# EAGLE design quantizer2_v40 (EAGLE 9.6.2)

## Sheet 1 of 2
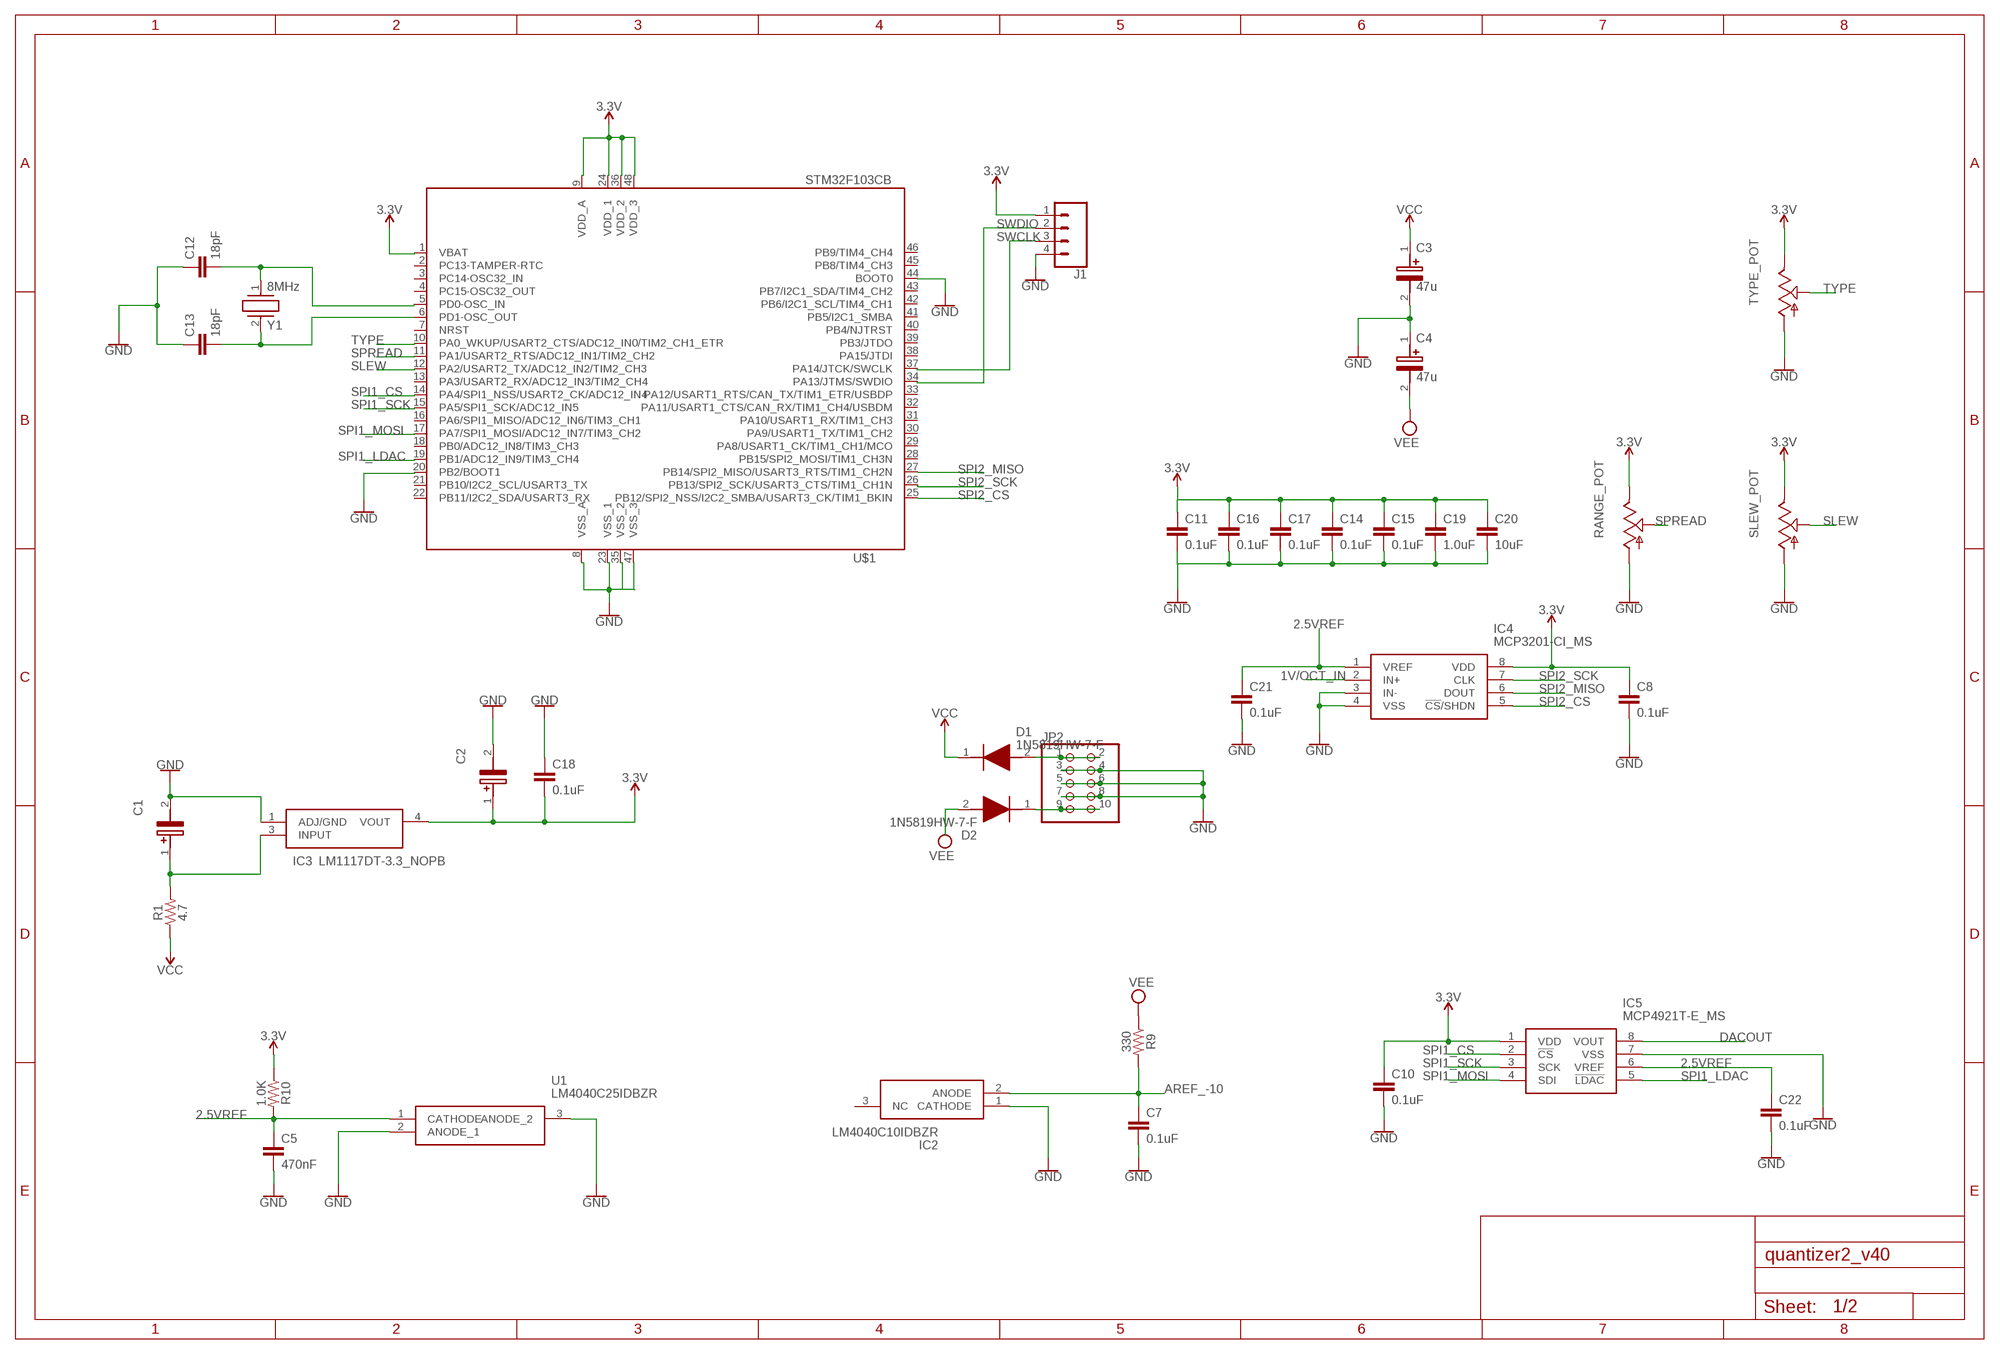
[diagram p0: schematic, sheet 1]

### Parts
C1  22uF  EEE-FP1E220AR  [EEE0GA101SR]
C2  22uF  EEE-FP1E220AR  [EEE0GA101SR]
C3  47u  EEE-FK1V470P  [EEE1AA101SP]
C4  47u  EEE-FK1V470P  [EEE1AA101SP]
C5  470nF  0.1UF-0603-25V-(+80/-20%)  [0603]
C7  0.1uF  0.1UF-0603-25V-(+80/-20%)  [0603]
C8  0.1uF  0.1UF-0603-25V-5%  [0603]
C10  0.1uF  0.1UF-0603-25V-5%  [0603]
C11  0.1uF  0.1UF-0603-25V-5%  [0603]
C12  18pF  18PF-0603-50V-5%  [0603]
C13  18pF  18PF-0603-50V-5%  [0603]
C14  0.1uF  0.1UF-0603-25V-5%  [0603]
C15  0.1uF  0.1UF-0603-25V-5%  [0603]
C16  0.1uF  0.1UF-0603-25V-(+80/-20%)  [0603]
C17  0.1uF  0.1UF-0603-25V-(+80/-20%)  [0603]
C18  0.1uF  0.1UF-0603-25V-(+80/-20%)  [0603]
C19  1.0uF  1.0UF-0603-16V-10%  [0603]
C20  10uF  10UF-0603-6.3V-20%  [0603]
C21  0.1uF  0.1UF-0603-25V-5%  [0603]
C22  0.1uF  0.1UF-0603-25V-5%  [0603]
D1  1N5819HW-7-F  [SOD3716X145N]
D2  1N5819HW-7-F  [SOD3716X145N]
IC2  LM4040C10IDBZR  [SOT95P237X112-3N]
IC3  LM1117DT-3.3_NOPB  [TO228P991X238-3N]
IC4  MCP3201-CI_MS  [SOP65P490X110-8N]
IC5  MCP4921T-E_MS  [SOP65P490X110-8N]
J1  CONN_04  [1X04]
JP2  PINHD-2X5  [2X05]
R1  4.7  RESISTOR1206  [1206]
R9  330  RESISTOR0603  [0603]
R10  1.0K  RESISTOR0603  [0603]
RANGE_POT  POT_USVERTICAL_PS  [ALPS_POT_VERTICAL_PS]
SLEW_POT  POTENTIOMETER-ALPHA-9MM_VERTICAL_  [POTENTIOMETER-ALPHA-9MM_VERTICAL]
TYPE_POT  POT_USVERTICAL_PS  [ALPS_POT_VERTICAL_PS]
U1  LM4040C25IDBZR  [SOT95P237X112-3N]
U$1  STM32F103CB  [LQFP48]
Y1  8MHz  ABLS3-8.000MHZ-D4Y-T  [ABLS]

### Nets
1V/OCT_IN: IC4.2(IN+) ; also sheet 2
2.5VREF: C5.1 C21.1 C22.1 IC4.1(VREF) IC5.6(VREF) R10.2 U1.1(CATHODE)
3.3V: C2.1(+) C8.1 C10.1 C11.1 C14.1 C15.1 C16.1 C17.1 C18.2 C19.1 C20.1 IC3.4(VOUT) IC4.8(VDD) IC5.1(VDD) J1.1 R10.1 RANGE_POT.P$1(E) SLEW_POT.3(E) TYPE_POT.P$1(E) U$1.1(VBAT) U$1.9(VDD_A) U$1.24(VDD_1) U$1.36(VDD_2) U$1.48(VDD_3)
AREF_-10: C7.1 IC2.2(ANODE) R9.2 ; also sheet 2
DACOUT: IC5.8(VOUT) ; also sheet 2
GND: C1.2(-) C2.2(-) C3.2(-) C4.1(+) C5.2 C7.2 C8.2 C10.2 C12.1 C13.1 C18.1 C21.2 C22.2 IC2.1(CATHODE) IC3.1(ADJ/GND) IC4.3(IN-) IC4.4(VSS) IC5.7(VSS) J1.4 JP2.3 JP2.4 JP2.5 JP2.6 JP2.7 JP2.8 RANGE_POT.P$3(A) SLEW_POT.1(A) TYPE_POT.P$3(A) U1.2(ANODE_1) U1.3(ANODE_2) U$1.8(VSS_A) U$1.20(PB2/BOOT1) U$1.23(VSS_1) U$1.35(VSS_2) U$1.44(BOOT0) U$1.47(VSS_3) ; also sheet 2
N$2: C1.1(+) IC3.3(INPUT) R1.2
N$4: D1.2(A) JP2.1 JP2.2
N$6: D2.1(K) JP2.9 JP2.10
N$10: C12.2 U$1.5(PD0-OSC_IN) Y1.1
N$11: C13.2 U$1.6(PD1-OSC_OUT) Y1.2
N$12: C11.2 C14.2 C15.2 C16.2 C17.2 C19.2 C20.2 ; supply symbol labelled GND
SLEW: SLEW_POT.2(S) U$1.12(PA2/USART2_TX/ADC12_IN2/TIM2_CH3)
SPI1_CS: IC5.2(!CS) U$1.14(PA4/SPI1_NSS/USART2_CK/ADC12_IN4)
SPI1_LDAC: IC5.5(!LDAC) U$1.19(PB1/ADC12_IN9/TIM3_CH4)
SPI1_MOSI: IC5.4(SDI) U$1.17(PA7/SPI1_MOSI/ADC12_IN7/TIM3_CH2)
SPI1_SCK: IC5.3(SCK) U$1.15(PA5/SPI1_SCK/ADC12_IN5)
SPI2_CS: IC4.5(!CS!/SHDN) U$1.25(PB12/SPI2_NSS/I2C2_SMBA/USART3_CK/TIM1_BKIN)
SPI2_MISO: IC4.6(DOUT) U$1.27(PB14/SPI2_MISO/USART3_RTS/TIM1_CH2N)
SPI2_SCK: IC4.7(CLK) U$1.26(PB13/SPI2_SCK/USART3_CTS/TIM1_CH1N)
SPREAD: RANGE_POT.P$2(S) U$1.11(PA1/USART2_RTS/ADC12_IN1/TIM2_CH2)
SWCLK: J1.3 U$1.37(PA14/JTCK/SWCLK)
SWDIO: J1.2 U$1.34(PA13/JTMS/SWDIO)
TYPE: TYPE_POT.P$2(S) U$1.10(PA0_WKUP/USART2_CTS/ADC12_IN0/TIM2_CH1_ETR)
VCC: C3.1(+) D1.1(K) R1.1 ; also sheet 2
VEE: C4.2(-) D2.2(A) R9.1 ; also sheet 2
Unconnected: IC2.3(NC) U$1.2(PC13-TAMPER-RTC) U$1.3(PC14-OSC32_IN) U$1.4(PC15-OSC32_OUT) U$1.7(NRST) U$1.13(PA3/USART2_RX/ADC12_IN3/TIM2_CH4) U$1.16(PA6/SPI1_MISO/ADC12_IN6/TIM3_CH1) U$1.18(PB0/ADC12_IN8/TIM3_CH3) U$1.21(PB10/I2C2_SCL/USART3_TX) U$1.22(PB11/I2C2_SDA/USART3_RX) U$1.28(PB15/SPI2_MOSI/TIM1_CH3N) U$1.29(PA8/USART1_CK/TIM1_CH1/MCO) U$1.30(PA9/USART1_TX/TIM1_CH2) U$1.31(PA10/USART1_RX/TIM1_CH3) U$1.32(PA11/USART1_CTS/CAN_RX/TIM1_CH4/USBDM) U$1.33(PA12/USART1_RTS/CAN_TX/TIM1_ETR/USBDP) U$1.38(PA15/JTDI) U$1.39(PB3/JTDO) U$1.40(PB4/NJTRST) U$1.41(PB5/I2C1_SMBA) U$1.42(PB6/I2C1_SCL/TIM4_CH1) U$1.43(PB7/I2C1_SDA/TIM4_CH2) U$1.45(PB8/TIM4_CH3) U$1.46(PB9/TIM4_CH4)

## Sheet 2 of 2
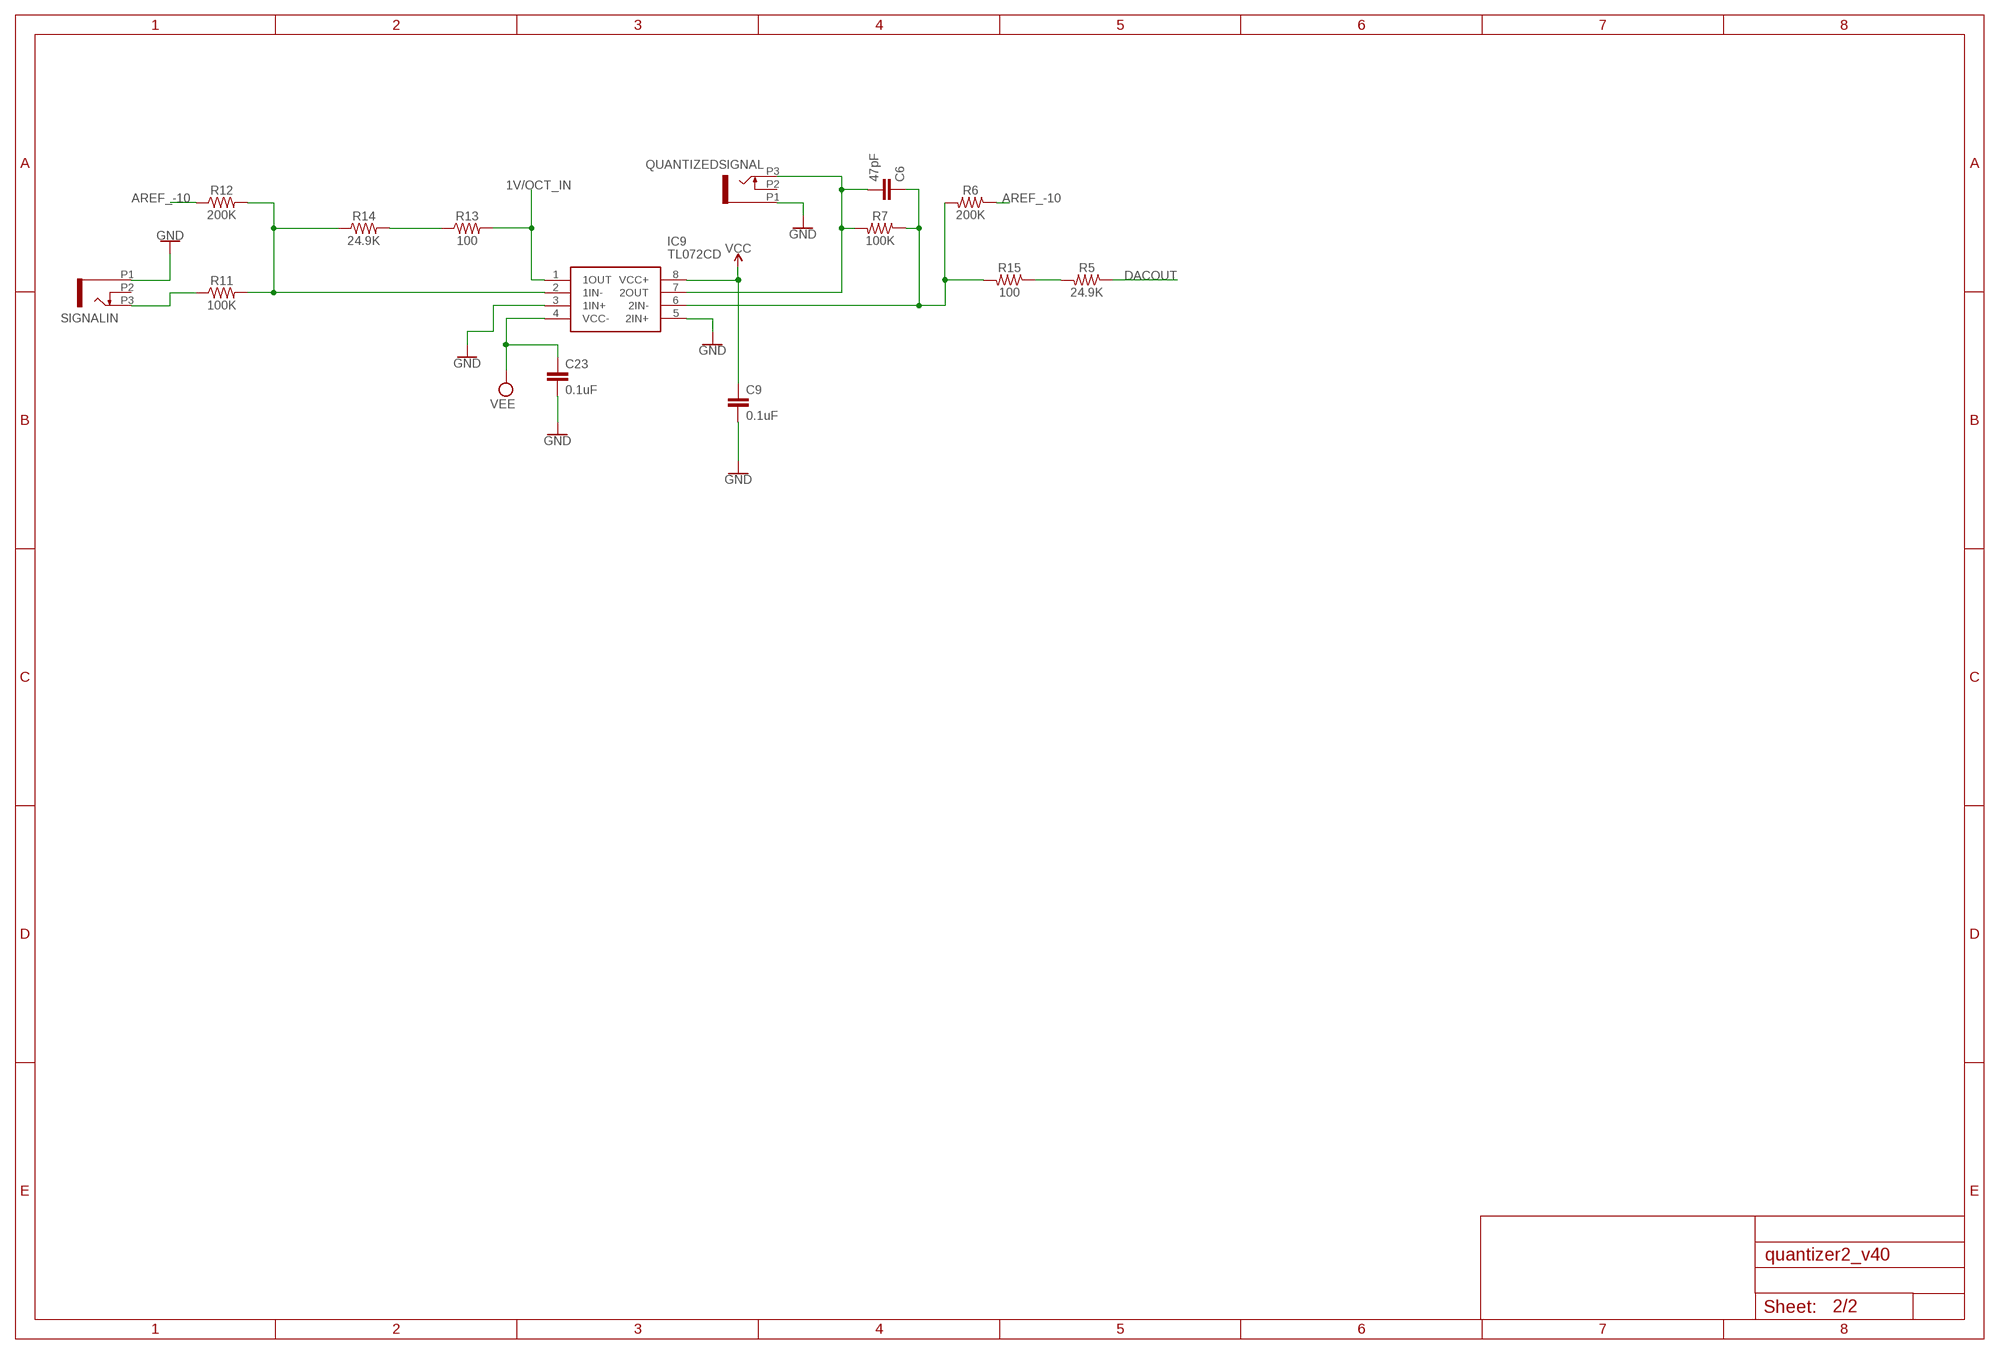
[diagram p1: schematic, sheet 2]

### Parts
C6  47pF  0.1UF-0603-25V-(+80/-20%)  [0603]
C9  0.1uF  0.1UF-0603-25V-(+80/-20%)  [0603]
C23  0.1uF  0.1UF-0603-25V-(+80/-20%)  [0603]
IC9  TL072CD  [SOIC127P600X175-8N]
QUANTIZEDSIGNAL  PJ301_THONKICONN6  [WQP_PJ_301M6]
R5  24.9K  RESISTOR0603  [0603]
R6  200K  RESISTOR0603  [0603]
R7  100K  RESISTOR0603  [0603]
R11  100K  RESISTOR0603  [0603]
R12  200K  RESISTOR0603  [0603]
R13  100  RESISTOR0603  [0603]
R14  24.9K  RESISTOR0603  [0603]
R15  100  RESISTOR0603  [0603]
SIGNALIN  PJ301_THONKICONN6  [WQP_PJ_301M6]

### Nets
1V/OCT_IN: IC9.1(1OUT) R13.2 ; also sheet 1
AREF_-10: R6.1 R12.1 ; also sheet 1
DACOUT: R5.1 ; also sheet 1
GND: C9.2 C23.2 IC9.3(1IN+) IC9.5(2IN+) QUANTIZEDSIGNAL.P1 SIGNALIN.P1 ; also sheet 1
N$5: R11.1 SIGNALIN.P3
N$8: IC9.2(1IN-) R11.2 R12.2 R14.1
N$13: C6.2 IC9.7(2OUT) QUANTIZEDSIGNAL.P3 R7.2
N$15: R13.1 R14.2
N$16: R5.2 R15.1
N$17: C6.1 IC9.6(2IN-) R6.2 R7.1 R15.2
VCC: C9.1 IC9.8(VCC+) ; also sheet 1
VEE: C23.1 IC9.4(VCC-) ; also sheet 1
Unconnected: QUANTIZEDSIGNAL.P2 SIGNALIN.P2

## Library data of the parts
C1 C2 = EEE-FP1E220AR:EEE-FP1E220AR: PANASONIC - EEEFP1E220AR - SMD Aluminium Electrolytic Capacitor, Radial Can - SMD, 22 F, 25 V, 0.36 ohm, FP Series Source: Datasheet <http://industrial.panasonic.com/cdbs/www-data/pdf/RDE0000/ABA0000C1184.pdf>; DESCRIPTION: PANASONIC - EEEFP1E220AR - SMD Aluminium Electrolytic Capacitor, Radial Can - SMD, 22 F, 25 V, 0.36 ohm, FP Series; HEIGHT: 6.5mm; MANUFACTURER_NAME: Panasonic; MANUFACTURER_PART_NUMBER: EEE-FP1E220AR; MOUSER_PART_NUMBER: 667-EEE-FP1E220AR; MOUSER_PRICE-STOCK: https://www.mouser.co.uk/ProductDetail/Panasonic/EEE-FP1E220AR?qs=d1CqaRUMZD%252ByxlCLn0gmaw%3D%3D
C3 C4 = EEE-FK1V470P:EEE-FK1V470P: Aluminum Electrolytic Capacitors - SMD 47uF 35V Source: Datasheet <http://industrial.panasonic.com/cdbs/www-data/pdf/RDE0000/ABA0000C1181.pdf>; DESCRIPTION: Aluminum Electrolytic Capacitors - SMD 47uF 35V; HEIGHT: 7.8mm; MANUFACTURER_NAME: Panasonic; MANUFACTURER_PART_NUMBER: EEE-FK1V470P; MOUSER_PART_NUMBER: 667-EEE-FK1V470P; MOUSER_PRICE-STOCK: https://www.mouser.co.uk/ProductDetail/Panasonic/EEE-FK1V470P?qs=qE6bgDGEOCuVUX5CkiabHQ%3D%3D
C5 C6 = SparkFun-Capacitors:0.1UF: 0.1µF ceramic capacitors A capacitor is a passive two-terminal electrical component used to store electrical energy temporarily in an electric field.; PROD_ID: CAP-00810; VALUE: 0.1uF
C7 C9 C16-C18 C23 = SparkFun-Capacitors:0.1UF: 0.1µF ceramic capacitors A capacitor is a passive two-terminal electrical component used to store electrical energy temporarily in an electric field.; PROD_ID: CAP-00810
C8 C10 C11 C14 C15 C21 C22 = SparkFun-Capacitors:0.1UF: 0.1µF ceramic capacitors A capacitor is a passive two-terminal electrical component used to store electrical energy temporarily in an electric field.; PROD_ID: CAP-08604
C12 C13 = SparkFun-Capacitors:18PF: 18pF ceramic capacitors A capacitor is a passive two-terminal electrical component used to store electrical energy temporarily in an electric field.; PROD_ID: CAP-08267
C19 = SparkFun-Capacitors:1.0UF: 1µF ceramic capacitors A capacitor is a passive two-terminal electrical component used to store electrical energy temporarily in an electric field.; PROD_ID: CAP-00868
C20 = SparkFun-Capacitors:10UF: 10.0µF ceramic capacitors A capacitor is a passive two-terminal electrical component used to store electrical energy temporarily in an electric field.; PROD_ID: CAP-11015
D1 D2 = 1N5819HW-7-F:1N5819HW-7-F: Diode Schottky 1A 40V SOD123 Diodes Inc 1N5819HW-7-F, SMT Schottky Diode, 40V 1A, 2-Pin SOD-123 Source: Datasheet <https://datasheet.datasheetarchive.com/originals/distributors/Datasheets-DGA23/1390892.pdf>; DESCRIPTION: Diode Schottky 1A 40V SOD123 Diodes Inc 1N5819HW-7-F, SMT Schottky Diode, 40V 1A, 2-Pin SOD-123; HEIGHT: 1.45mm; MANUFACTURER_NAME: Diodes Inc.; MANUFACTURER_PART_NUMBER: 1N5819HW-7-F; MOUSER_PART_NUMBER: 621-1N5819HW-F; MOUSER_PRICE-STOCK: https://www.mouser.co.uk/ProductDetail/Diodes-Incorporated/1N5819HW-7-F?qs=NQ47qNm99eDyWTEd07miYA%3D%3D
IC2 = LM4040C10IDBZR:LM4040C10IDBZR: PRECISION MICROPOWER SHUNT VOLTAGE REFERENCE Source: Datasheet <http://www.ti.com/lit/gpn/lm4040>; DESCRIPTION: PRECISION MICROPOWER SHUNT VOLTAGE REFERENCE; HEIGHT: mm; MANUFACTURER_NAME: Texas Instruments; MANUFACTURER_PART_NUMBER: LM4040C10IDBZR; MOUSER_PART_NUMBER: 595-LM4040C10IDBZR; MOUSER_PRICE-STOCK: https://www.mouser.com/Search/Refine.aspx?Keyword=595-LM4040C10IDBZR
IC3 = LM1117DT-3.3_NOPB:LM1117DT-3.3_NOPB: Space saving 800-mA low-dropout linear regulator with internal current limit Source: Datasheet <https://datasheet.datasheetarchive.com/originals/distributors/Datasheets-SFU2/DSASFU100036103.pdf>; DESCRIPTION: Space saving 800-mA low-dropout linear regulator with internal current limit; HEIGHT: 2.38mm; MANUFACTURER_NAME: Texas Instruments; MANUFACTURER_PART_NUMBER: LM1117DT-3.3/NOPB; MOUSER_PART_NUMBER: 926-LM1117DT-3.3NOPB; MOUSER_PRICE-STOCK: https://www.mouser.co.uk/ProductDetail/Texas-Instruments/LM1117DT-3.3-NOPB?qs=X1J7HmVL2ZHOT670myqy2w%3D%3D
IC4 = MCP3201-CI_MS:MCP3201-CI_MS: Analog to Digital Converters - ADC 12-bit SPI Sgl Chl Source: Datasheet <http://www.microchip.com/mymicrochip/filehandler.aspx?ddocname=en011279>; DESCRIPTION: Analog to Digital Converters - ADC 12-bit SPI Sgl Chl; HEIGHT: 1.1mm; MANUFACTURER_NAME: Microchip; MANUFACTURER_PART_NUMBER: MCP3201-CI/MS; MOUSER_PART_NUMBER: 579-MCP3201-CI/MS; MOUSER_PRICE-STOCK: https://www.mouser.co.uk/ProductDetail/Microchip-Technology-Atmel/MCP3201-CI-MS?qs=mcPJWgAPNrdThuaOU%2FBAFA%3D%3D
IC5 = MCP4921T-E_MS:MCP4921T-E_MS: Digital to Analog Converters - DAC Sgl 12-bit SPI int Source: Datasheet <http://www.microchip.com/mymicrochip/filehandler.aspx?ddocname=en547911>; DESCRIPTION: Digital to Analog Converters - DAC Sgl 12-bit SPI int; HEIGHT: 1.1mm; MANUFACTURER_NAME: Microchip; MANUFACTURER_PART_NUMBER: MCP4921T-E/MS; MOUSER_PART_NUMBER: 579-MCP4921T-E/MS; MOUSER_PRICE-STOCK: https://www.mouser.co.uk/ProductDetail/Microchip-Technology/MCP4921T-E-MS?qs=fM4xO01eazMZI7WjXZqD2A%3D%3D
IC9 = TL072CD:TL072CD: Dual Low-Noise JFET-Input General-Purpose Operational Amplifier Source: Datasheet <http://www.ti.com/lit/ds/symlink/tl072.pdf>; DESCRIPTION: Dual Low-Noise JFET-Input General-Purpose Operational Amplifier; HEIGHT: 1.75mm; MANUFACTURER_NAME: Texas Instruments; MANUFACTURER_PART_NUMBER: TL072CD; MOUSER_PART_NUMBER: 595-TL072CD; MOUSER_PRICE-STOCK: https://www.mouser.co.uk/ProductDetail/Texas-Instruments/TL072CD?qs=5nGYs9Do7G0niDPig1J2Tw%3D%3D
J1 = SparkFun-Connectors:CONN_04: Multi connection point. Often used as Generic Header-pin footprint for 0.1 inch spaced/style header connections On any of the 0.1 inch spaced packages, you can populate with these: Break Away Headers - Straight <https://www.sparkfun.com/products/116> (PRT-00116) Break Away Male Headers - Right Angle <https://www.sparkfun.com/products/553> (PRT-00553) Female Headers <https://www.sparkfun.com/products/115> (PRT-00115) Break Away Headers - Machine Pin <https://www.sparkfun.com/products/117> (PRT-00117) Break Away Female Headers - Swiss Machine Pin <https://www.sparkfun.com/products/743> (PRT-00743) For SCREWTERMINALS and SPRING TERMINALS visit here: Screw Terimnals on SparkFun.com <https://www.sparkfun.com/search/results?term=Screw+Terminals> (5mm/3.5mm/2.54mm spacing) This device is also useful as a general connection point to wire up your design to another part of your project. Our various solder wires solder well into these plated through hole pads. Hook-Up Wire - Assortment (Stranded, 22 AWG) <https://www.sparkfun.com/products/11375> (PRT-11375) Hook-Up Wire - Assortment (Solid Core, 22 AWG) <https://www.sparkfun.com/products/11367> (PRT-11367) View the entire wire category on our website here <https://www.sparkfun.com/categories/141> Special notes: Molex polarized connector foot print use with SKU : PRT-08231 with associated crimp pins and housings. 1MM SMD Version SKU: PRT-10208; PROD_ID: CONN-09696
JP2 = pinhead:PINHD-2X5: PIN HEADER
QUANTIZEDSIGNAL SIGNALIN = og-pj301_variations:PJ301_THONKICONN
R1 R5-R7 R9-R15 = SparkFun-Resistors:RESISTOR: Generic Resistor Package
RANGE_POT TYPE_POT = og-pots:POT_US
SLEW_POT = EURACK-MASTER-LIB:POTENTIOMETER-ALPHA-9MM_VERTICAL: 9mm vertical snap-in pot, Alpha / Panasonic style
U1 = LM4040C25IDBZR:LM4040C25IDBZR: TEXAS INSTRUMENTS - LM4040C25IDBZR - VOLTAGE REF, SHUNT, 2.5V, SOT-23-3 Source: Datasheet <https://datasheet.datasheetarchive.com/originals/distributors/Datasheets-DGA16/867624.pdf>; DESCRIPTION: TEXAS INSTRUMENTS - LM4040C25IDBZR - VOLTAGE REF, SHUNT, 2.5V, SOT-23-3; HEIGHT: 1.12mm; MANUFACTURER_NAME: Texas Instruments; MANUFACTURER_PART_NUMBER: LM4040C25IDBZR; MOUSER_PART_NUMBER: 595-LM4040C25IDBZR; MOUSER_PRICE-STOCK: https://www.mouser.co.uk/ProductDetail/Texas-Instruments/LM4040C25IDBZR?qs=VBduBm9rCJStNYDGENjZXg%3D%3D
U$1 = stm32:STM32F103CB
Y1 = ABLS3-8.000MHZ-D4Y-T:ABLS3-8.000MHZ-D4Y-T: HC49/US (AT49) LOW PROFILE SMD MICROPROCESSOR CRYSTAL Source: Datasheet <https://abracon.com/Resonators/abls.pdf>; DESCRIPTION: HC49/US (AT49) LOW PROFILE SMD MICROPROCESSOR CRYSTAL; HEIGHT: mm; MANUFACTURER_NAME: ABRACON; MANUFACTURER_PART_NUMBER: ABLS3-8.000MHZ-D4Y-T; MOUSER_PART_NUMBER: 815-ABLS3-8MD4YT; MOUSER_PRICE-STOCK: https://www.mouser.co.uk/ProductDetail/ABRACON/ABLS3-8000MHZ-D4Y-T?qs=WRzgYYgs9gC3im7pazpFGA%3D%3D

## Board
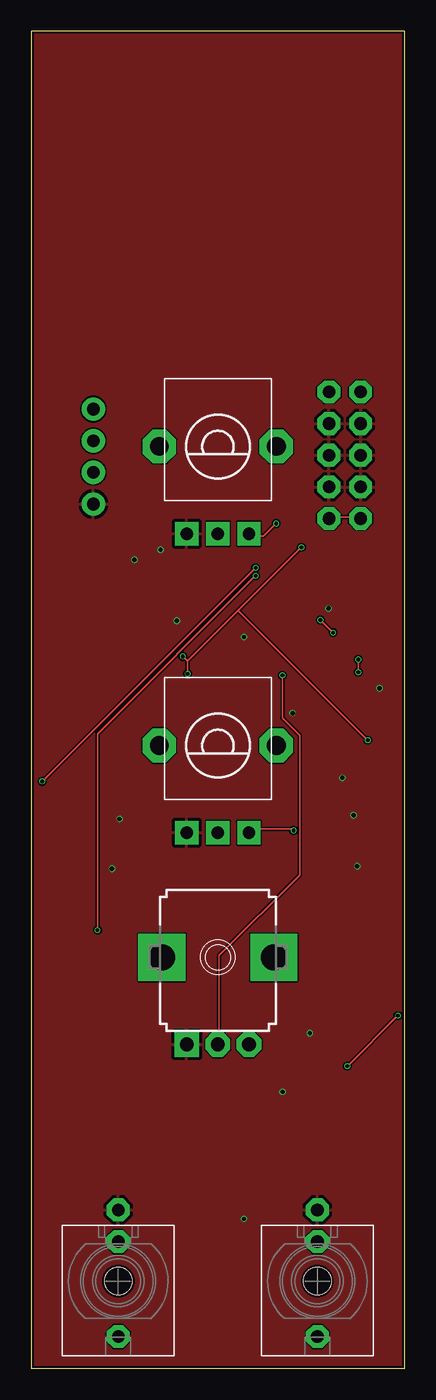
[diagram p2: board, top side]
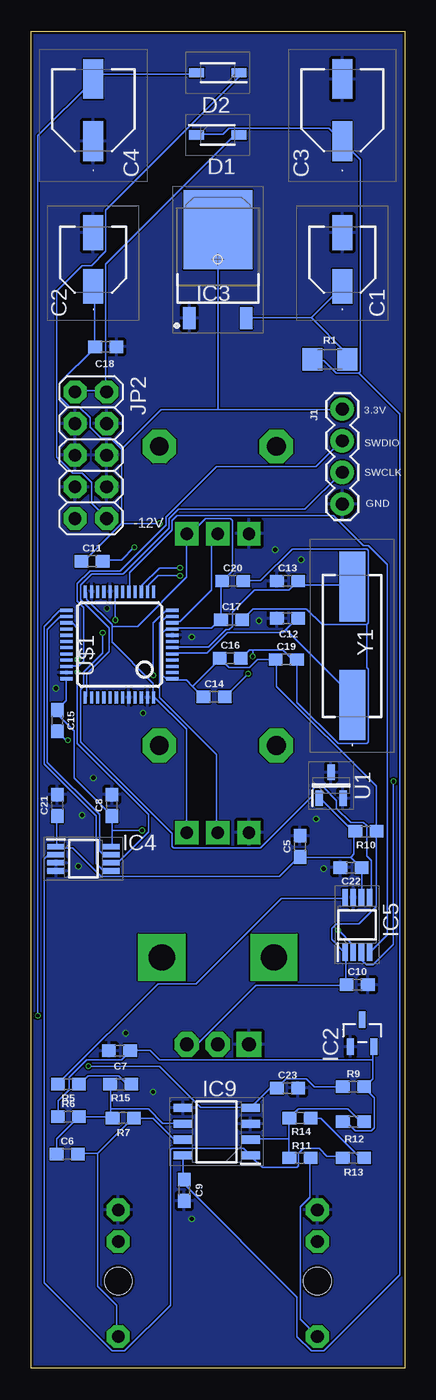
[diagram p3: board, bottom side, seen from below]

Size 30 x 107.34 mm. Coordinates in mm from the lower left corner, seen from the top.
Outline: 0,0 30,0 30,107.34 0,107.34 0,0
Copper layers (1*16): Top 0.035mm / dielectric 1.6mm / Bottom 0.035mm
Design rules "jlcpcb-2layers": minimum track width 5mil, minimum drill 0.3mm, track to track 5mil, track to pad 5mil, pad to pad 5mil, via to via 5mil, smd to smd 5mil, copper to edge 0.2mm, drill to drill 6mil, minimum pad ring 10mil, minimum via ring 3mil, stop-mask expansion 4mil, vias tented up to drill 0mil, thermal gap 10mil

### Footprints (pad centres in the part's own frame; a part is rotated, then mirrored left to right if it is on the bottom)
EEE0GA101SR = smd 2.8 x 1.6: 1 -2.15,0; 2 2.15,0
EEE1AA101SP = smd 3.2 x 1.6: 1 -2.5,0; 2 2.5,0
0603 = smd 1.1 x 1: 1 -0.85,0; 2 0.85,0
SOD3716X145N = smd 1.2 x 0.75: 1 -1.7,0; 2 1.7,0
SOT95P237X112-3N = smd 1.321 x 0.559: 1 -1.092,0.94; 2 -1.092,-0.94 | smd 1.321 x 0.508: 3 1.092,0
TO228P991X238-3N = smd 1.75 x 1: 1 -4.7,2.285; 3 -4.7,-2.285 | smd 6.35 x 5.55: 4 2.4,0
SOP65P490X110-8N = smd 1.4 x 0.45: 1 -2.2,0.975; 2 -2.2,0.325; 3 -2.2,-0.325; 4 -2.2,-0.975; 5 2.2,-0.975; 6 2.2,-0.325; 7 2.2,0.325; 8 2.2,0.975
SOIC127P600X175-8N = smd 1.528 x 0.65: 1 -2.711,1.905; 2 -2.711,0.635; 3 -2.711,-0.635; 4 -2.711,-1.905; 5 2.711,-1.905; 6 2.711,-0.635; 7 2.711,0.635; 8 2.711,1.905
1X04 = drill 1.016 pad 1.88: 1 0,0; 2 2.54,0; 3 5.08,0; 4 7.62,0
2X05 = drill 1.016 octagon: 1 -5.08,-1.27; 2 -5.08,1.27; 3 -2.54,-1.27; 4 -2.54,1.27; 5 0,-1.27; 6 0,1.27; 7 2.54,-1.27; 8 2.54,1.27; 9 5.08,-1.27; 10 5.08,1.27
WQP_PJ_301M6 = drill 1.016 pad 1.778 octagon: P1 0,-5.715; P2 0,-3.175; P3 0,4.445 | hole 2.2: 0,0
1206 = smd 1.6 x 1.8: 1 -1.4,0; 2 1.4,0
ALPS_POT_VERTICAL_PS = drill 1 pad 1.88 square: P$1 -2.5,7; P$2 0,7; P$3 2.5,7 | drill 1.5 pad 2.54 octagon: P$4 -4.7,0; P$5 4.7,0
POTENTIOMETER-ALPHA-9MM_VERTICAL = drill 1.1 pad 1.676 square: 1 -2.5,-7 | drill 1.1 pad 1.676 octagon: 2 0,-7; 3 2.5,-7 | drill 2.1 pad 2.8 square: M1 4.5,0; M2 -4.5,0
SOT95P237X112-3N' = smd 1.25 x 0.6: 1 -1.05,0.95; 2 -1.05,-0.95; 3 1.05,0
LQFP48 = smd 0.254 x 1: 1 -2.75,-4.25; 2 -2.25,-4.25; 3 -1.75,-4.25; 4 -1.25,-4.25; 5 -0.75,-4.25; 6 -0.25,-4.25; 7 0.25,-4.25; 8 0.75,-4.25; 9 1.25,-4.25; 10 1.75,-4.25; 11 2.25,-4.25; 12 2.75,-4.25; 25 2.75,4.25; 26 2.25,4.25; 27 1.75,4.25; 28 1.25,4.25; 29 0.75,4.25; 30 0.25,4.25; 31 -0.25,4.25; 32 -0.75,4.25; 33 -1.25,4.25; 34 -1.75,4.25; 35 -2.25,4.25; 36 -2.75,4.25 | smd 1 x 0.254: 13 4.25,-2.75; 14 4.25,-2.25; 15 4.25,-1.75; 16 4.25,-1.25; 17 4.25,-0.75; 18 4.25,-0.25; 19 4.25,0.25; 20 4.25,0.75; 21 4.25,1.25; 22 4.25,1.75; 23 4.25,2.25; 24 4.25,2.75; 37 -4.25,2.75; 38 -4.25,2.25; 39 -4.25,1.75; 40 -4.25,1.25; 41 -4.25,0.75; 42 -4.25,0.25; 43 -4.25,-0.25; 44 -4.25,-0.75; 45 -4.25,-1.25; 46 -4.25,-1.75; 47 -4.25,-2.25; 48 -4.25,-2.75
ABLS = smd 5.6 x 2.1: 1 -4.75,0; 2 4.75,0

### Placement (x,y rotation side)
C1  5,89 90 bottom
C2  25,89 90 bottom
C3  5,101 90 bottom
C4  25,101 90 bottom
C5  8.4,41.9 90 bottom
C6  27.1,17.2 0 bottom
C7  22.9,25.5 180 bottom
C8  23.5,45.2 90 bottom
C9  17.7,14.3 270 bottom
C10  3.8,30.8 0 bottom
C11  25.1,64.8 0 bottom
C12  9.4,60.2 0 bottom
C13  9.4,63.2 0 bottom
C14  15.3,53.9 0 bottom
C15  27.9,52 270 bottom
C16  14,57 0 bottom
C17  13.9,60.1 0 bottom
C18  24,82 180 bottom
C19  9.5,56.9 0 bottom
C20  13.8,63.2 0 bottom
C21  27.9,45.2 90 bottom
C22  4.3,40.2 180 bottom
C23  9.4,22.5 0 bottom
D1  15,99 0 bottom
D2  15,104 180 bottom
IC2  3.4,26.9 90 bottom
IC3  15,89 90 bottom
IC4  25.8,40.9 0 bottom
IC5  3.8,35.6 90 bottom
IC9  15.1,19 180 bottom
J1  5,77 270 bottom
JP2  25.2,73.3 270 bottom
QUANTIZEDSIGNAL  23,7 180 top
R1  6,81 0 bottom
R5  27,22.8 0 bottom
R6  27,20.2 0 bottom
R7  22.6,20.1 0 bottom
R9  4.1,22.6 0 bottom
R10  3.1,43.1 180 bottom
R11  8.4,16.9 180 bottom
R12  4.1,19.8 0 bottom
R13  4.1,16.9 180 bottom
R14  8.4,20.1 0 bottom
R15  22.8,22.8 180 bottom
RANGE_POT  15,50 180 top
SIGNALIN  7,7 180 top
SLEW_POT  15,33 0 top
TYPE_POT  15,74 180 top
U1  LM4040C25IDBZR  [SOT95P237X112-3N']  5.9,46.8 90 bottom
U$1  22.9,58.1 90 bottom
Y1  4.2,58 90 bottom

### Tracks (layer width: path | path; a pad name or v marks a point on that pad's centre or on a via)
1V/OCT_IN
  Bottom 0.127: R13.2 4.95,17.02 6.22,17.02 6.86,17.65 8.13,17.65 8.51,17.27 8.51,16.26 8.64,16.13 11.43,16.13 12.32,17.02 IC9.1 12.45,17.14 12.95,17.65 18.67,17.65 18.8,17.53 18.8,5.08 22.48,1.4 23.5,1.4 28.96,6.86 28.96,40.89 28.7,41.15 28.07,41.15 IC4.2
2.5VREF
  Bottom 0.127: C21.1 27.94,44.32 27.94,41.91 IC4.1 27.94,41.78 26.67,41.78 24.38,39.5 10.03,39.5 8.51,41.02 C5.1 8.38,41.02 4.32,41.02 | IC5.6 3.43,37.85 3.43,40.13 C22.1 3.56,40.26 4.32,41.02 | 4.06,43.05 4.06,41.27 4.32,41.02 | 4.06,43.05 6.73,45.72 U1.1 | 4.06,43.05 R10.2
3.3V  (via drill 0.3)
  Top 0.127: v21.08,43.18 20.95,43.31 17.78,43.31 17.53,43.05 RANGE_POT.P$1 | v19.68,67.82 18.67,66.8 17.65,66.8 17.53,66.93 TYPE_POT.P$1
  Bottom 0.127: C2.1 24.89,86.74 24.89,82.04 C18.2 24.89,81.92 27.69,79.12 27.69,77.98 26.92,77.22 26.16,77.22 25.27,76.33 25.27,75.56 24.38,74.68 23.62,74.68 22.73,73.79 | 22.73,67.82 25.65,64.9 25.91,64.9 C11.1 | 22.73,73.79 22.73,67.82 | 14.99,76.96 19.56,76.96 22.73,73.79 | 14.99,76.96 5.08,76.96 J1.1 | 14.99,76.96 14.99,91.31 IC3.4 | SLEW_POT.3 17.4,26.04 16.64,26.04 11.94,30.73 4.7,30.73 C10.1 4.7,30.86 4.7,33.27 IC5.1 4.83,33.4 5.84,34.42 5.84,35.31 5.46,35.69 3.68,35.69 2.29,37.08 2.29,43.05 R10.1 2.29,43.18 2.29,46.74 10.29,54.74 10.29,56.9 C19.1 10.41,56.9 11.81,56.9 12.45,56.26 14.1,56.26 14.73,56.9 C16.1 14.86,56.9 17.02,54.74 | 17.02,54.74 16.26,53.98 C14.1 | 17.02,54.74 17.53,55.24 18.54,55.24 U$1.1 18.67,55.37 19.18,55.37 19.43,55.63 19.43,59.05 19.18,59.31 18.67,59.31 U$1.9 18.54,59.44 15.49,59.44 14.86,60.07 C17.1 14.73,60.2 14.73,63.12 C20.1 14.61,63.25 13.84,64.01 13.84,68.07 13.97,68.2 16,68.2 17.14,67.06 17.4,67.06 TYPE_POT.P$1 17.53,66.93 17.53,63.5 21.46,59.56 23.5,59.56 | U$1.36 27.18,55.24 27.18,53.59 27.81,52.96 C15.1 27.81,52.83 27.81,52.45 26.54,51.18 26.54,47.37 23.62,44.45 C8.1 23.5,44.32 23.5,43.18 | 23.5,43.18 23.5,41.91 IC4.8 | 23.5,59.56 23.5,59.69 25.53,61.72 25.53,62.23 U$1.24 | 23.5,59.56 23.5,58.29 20.19,54.99 20.19,53.98 U$1.48 20.07,53.85 17.53,51.31 17.53,43.05 RANGE_POT.P$1 | v21.08,43.18 23.5,43.18 | v19.68,67.82 22.73,67.82
AREF_-10
  Bottom 0.127: R12.1 4.83,19.68 4.57,19.68 3.94,19.05 2.67,19.05 2.41,19.3 2.41,21.72 3.17,22.48 R9.2 3.17,22.61 2.54,23.24 2.54,24.77 | 2.54,24.77 2.54,25.78 IC2.2 | R6.1 27.81,20.32 27.81,21.46 26.92,22.35 26.92,23.37 25.53,24.77 22.73,24.77 22.1,25.4 C7.1 21.97,25.53 20.45,25.53 19.68,24.77 2.54,24.77
DACOUT
  Bottom 0.127: R5.1 27.81,22.86 19.81,30.86 16.76,30.86 9.91,37.72 4.83,37.72 IC5.8
GND  (via drill 0.35)
  other vias: 20.2,22.2 22.4,26.9 23.9,61 17.1,58.7 21,52.6 28,54.6 7.1,44.1 6.5,40.1 10.4,65.7 8.3,64.9 11.7,60 26.2,40.3 25.9,44.4 25,47.4 17.1,12
  pour Top: 0,107.3 30,107.3 30,0 0,0
  pour Bottom: 0,107.3 30,107.3 30,0 0,0
N$2
  Bottom 0.127: 7.49,84.33 12.7,84.33 IC3.3 | 7.49,84.33 5.08,86.74 C1.1 | 7.49,84.33 4.7,81.53 4.7,81.03 R1.2
N$4
  Bottom 0.127: 24,78.49 24,88.65 13.72,98.93 13.34,98.93 D1.2 | 24,78.49 26.42,78.49 JP2.1 | 24,78.49 JP2.2
N$5
  Bottom 0.127: SIGNALIN.P3 8.38,3.94 8.38,12.95 7.62,13.72 7.62,16.89 R11.1
N$6
  Top 0.127: JP2.9 26.42,68.33 24,68.33 JP2.10
  Bottom 0.127: D2.1 13.34,103.89 13.34,103.63 24,92.96 24,89.66 25.15,88.52 25.91,88.52 27.94,86.49 27.94,73.15 26.67,71.88 25.91,71.88 25.15,71.12 25.15,69.47 24,68.33 JP2.10
N$8
  Bottom 0.127: R12.2 3.3,19.81 3.56,19.81 4.57,20.83 8.51,20.83 9.14,20.19 R14.1 9.27,20.07 9.27,18.41 | 9.27,18.41 9.27,17.02 R11.2 | 9.27,18.41 12.32,18.41 IC9.2
N$10
  Bottom 0.127: 9.53,59.31 8.64,60.2 C12.2 | 9.53,59.31 9.78,59.05 14.22,59.05 15.88,57.4 18.54,57.4 U$1.5 | 9.53,59.31 4.32,54.1 4.32,53.34 Y1.1
N$11
  Bottom 0.127: U$1.6 18.54,57.91 15.75,57.91 14.35,59.31 14.1,59.31 13.84,59.56 13.84,60.71 12.06,62.48 9.27,62.48 8.64,63.12 C13.2 8.51,63.12 8.26,62.87 4.32,62.87 Y1.2
N$12  (via drill 0.3)
  Top 0.127: 12.57,56.77 v12.57,55.75 | v12.19,57.15 12.57,56.77 | 12.57,56.77 16.64,60.83 | 16.64,60.83 v21.72,65.91 | 16.64,60.83 v27.05,50.42
  Bottom 0.127: 3.05,59.69 2.92,59.82 2.92,65.66 3.05,65.79 9.02,65.79 11.56,63.25 12.83,63.25 C20.2 | 3.05,59.69 6.6,59.69 7.87,60.96 12.19,60.96 12.95,60.2 C17.2 | 12.19,57.66 12.45,57.66 13.08,57.02 C16.2 | 12.19,57.66 9.78,57.66 9.14,57.02 8.76,57.02 C19.2 8.64,56.9 8.64,53.47 5.33,50.16 3.05,50.16 2.92,50.29 2.92,56.13 3.05,56.26 3.05,59.69 | v12.57,55.75 14.35,53.98 C14.2 | 12.19,57.66 v12.19,57.15 | v21.72,65.91 22.73,64.9 24.13,64.9 C11.2 | v27.05,50.42 27.18,50.42 27.81,51.05 C15.2
N$13
  Bottom 0.127: IC9.7 17.91,18.41 18.54,18.41 20.19,20.07 21.72,20.07 R7.2 21.84,20.07 24.64,17.27 | 24.64,17.27 26.16,17.27 C6.2 | 24.64,17.27 24.64,6.6 23.11,5.08 23.11,2.67 QUANTIZEDSIGNAL.P3
N$15
  Bottom 0.127: R13.1 3.3,17.02 3.68,17.02 6.73,20.07 7.49,20.07 R14.2
N$16
  Bottom 0.127: R15.1 21.97,22.86 22.35,22.86 22.99,23.5 25.4,23.5 26.04,22.86 R5.2
N$17
  Bottom 0.127: 23.62,20.19 26.04,20.19 R6.2 26.16,20.19 27.94,18.41 27.94,17.27 C6.1 | 23.62,20.19 23.5,20.19 R7.1 23.62,20.19 | 23.62,20.19 23.62,20.83 | 23.62,20.83 23.62,22.73 R15.2 | 23.62,20.83 20.57,20.83 19.43,19.68 17.91,19.68 IC9.6
SLEW  (via drill 0.3)
  Top 0.127: v20.19,55.63 20.19,52.2 21.59,50.8 21.59,39.62 15.11,33.15 15.11,26.04 SLEW_POT.2
  Bottom 0.127: v20.19,55.63 20.19,59.82 19.18,60.83 18.67,60.83 U$1.12
SPI1_CS  (via drill 0.3)
  Top 0.127: v18.03,63.63 5.33,50.93 v5.33,35.18
  Bottom 0.127: v18.03,63.63 19.81,63.63 20.57,62.87 20.57,62.36 U$1.14 | v5.33,35.18 4.19,34.04 4.19,33.4 IC5.2
SPI1_LDAC  (via drill 0.3)
  Top 0.127: v24.26,59.05 v23.24,60.07
  Bottom 0.127: v23.24,60.07 23.24,62.23 U$1.19 | v24.26,59.05 24.26,57.4 25.78,55.88 25.78,54.74 26.04,54.48 26.04,50.29 18.67,42.93 18.67,41.91 18.54,41.78 11.56,41.78 7.37,45.97 7.37,46.48 7.24,46.61 6.48,46.61 5.46,45.59 5.46,44.96 4.32,43.81 3.3,43.81 3.05,43.56 3.05,41.15 2.67,40.77 2.67,37.97 2.79,37.85 IC5.5
SPI1_MOSI
  Bottom 0.127: U$1.17 22.1,62.36 22.1,63.88 18.67,67.31 18.67,68.07 18.29,68.45 5.71,68.45 3.3,66.04 2.92,66.04 1.4,64.52 1.4,34.8 2.79,33.4 IC5.4
SPI1_SCK  (via drill 0.3)
  Top 0.127: v0.89,47.12 v18.03,64.26
  Bottom 0.127: v18.03,64.26 19.68,64.26 21.08,62.87 21.08,62.36 U$1.15 | v0.89,47.12 0.89,34.04 2.54,32.38 3.05,32.38 3.43,32.77 3.43,33.27 IC5.3
SPI2_CS
  Bottom 0.127: U$1.25 27.18,60.83 27.69,60.83 28.96,59.56 28.96,48.51 24.77,44.32 24.77,40.51 24.26,40.01 23.62,40.01 IC4.5
SPI2_MISO  (via drill 0.3)
  Top 0.127: v26.29,55.88 v26.29,56.9
  Bottom 0.127: v26.29,56.9 26.29,59.44 26.67,59.82 27.05,59.82 U$1.27 | v26.29,55.88 26.29,50.16 20.57,44.45 20.57,43.05 22.99,40.64 23.5,40.64 IC4.6
SPI2_SCK
  Bottom 0.127: U$1.26 27.18,60.33 27.69,60.33 28.7,59.31 28.7,48.64 24.51,44.45 24.51,41.53 24.26,41.27 23.62,41.27 IC4.7
SPREAD
  Bottom 0.127: U$1.11 18.67,60.33 19.18,60.33 19.68,59.82 19.68,53.85 15.11,49.28 15.11,43.05 RANGE_POT.P$2
SWCLK
  Bottom 0.127: U$1.37 25.53,53.98 25.53,55.75 23.75,57.53 23.75,59.44 26.04,61.72 26.04,62.87 25.15,63.75 22.61,63.75 18.92,67.44 18.92,68.2 18.16,68.96 8,68.96 5.08,71.88 J1.3
SWDIO
  Bottom 0.127: U$1.34 27.05,56.39 26.16,56.39 25.78,56.77 25.78,61.09 26.29,61.59 26.29,62.99 25.27,64.01 22.86,64.01 19.18,67.69 19.18,68.33 15.11,72.39 7.11,72.39 5.08,74.42 J1.2
TYPE
  Bottom 0.127: U$1.10 18.54,59.94 18.03,59.94 15.49,62.48 15.49,66.55 15.11,66.93 TYPE_POT.P$2
VCC
  Bottom 0.127: IC9.8 17.78,17.02 17.78,15.24 C9.1 17.65,15.11 17.65,14.73 8.64,5.71 8.64,2.54 7.49,1.4 6.48,1.4 0.38,7.49 0.38,76.58 3.68,79.88 | D1.1 16.64,99.06 14.61,99.06 14.1,99.57 6.1,99.57 5.08,98.55 C3.1 4.95,98.42 3.56,97.03 3.56,80.01 3.68,79.88 | 3.68,79.88 5.46,79.88 6.48,80.9 7.37,80.9 R1.1
VEE  (via drill 0.3)
  Top 0.127: v29.46,28.32 v25.4,24.26
  Bottom 0.127: R9.1 7.24,22.61 7.87,23.24 9.53,23.24 10.16,22.61 C23.1 10.29,22.48 10.79,22.48 12.32,20.95 IC9.4 12.45,20.95 16.38,20.95 19.68,24.26 v25.4,24.26 | D2.2 16.76,103.89 24.51,103.89 24.89,103.5 C4.2 25.02,103.38 29.46,98.93 v29.46,28.32

### Text on the board
bPlace: -12V
bNames: 3.3V | SWDIO | SWCLK | GND